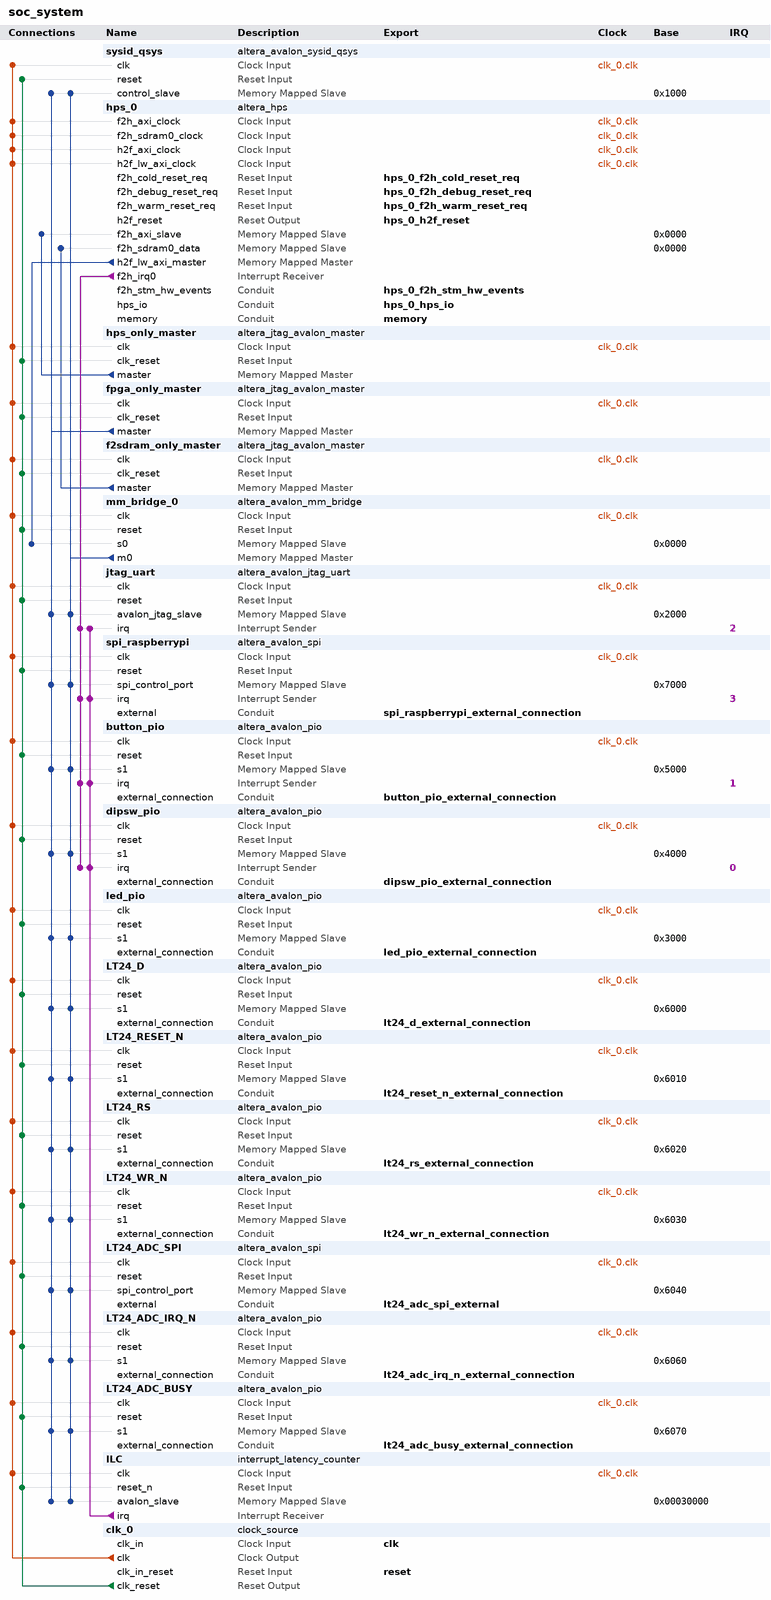
[diagram p0: system contents]
# Platform Designer (Qsys) system soc_system, Cyclone V 5CSEBA6U23I7
# Parameters at their usual value, and those the tool derives, are not listed.
package require -exact qsys 18.0
create_system soc_system
set_project_property DEVICE_FAMILY {Cyclone V}
set_project_property DEVICE 5CSEBA6U23I7

add_instance sysid_qsys altera_avalon_sysid_qsys 18.0
set_instance_parameter_value sysid_qsys id -1395322110

add_instance hps_0 altera_hps 18.0
set_instance_parameter_value hps_0 EMAC1_Mode RGMII
set_instance_parameter_value hps_0 EMAC1_PinMuxing {HPS I/O Set 0}
set_instance_parameter_value hps_0 F2SCLK_COLDRST_Enable true
set_instance_parameter_value hps_0 F2SCLK_DBGRST_Enable true
set_instance_parameter_value hps_0 F2SCLK_WARMRST_Enable true
set_instance_parameter_value hps_0 F2SDRAM_Type {Avalon-MM Bidirectional}
set_instance_parameter_value hps_0 F2SDRAM_Width 256
set_instance_parameter_value hps_0 F2SINTERRUPT_Enable true
set_instance_parameter_value hps_0 F2S_Width 2
set_instance_parameter_value hps_0 FPGA_PERIPHERAL_OUTPUT_CLOCK_FREQ_EMAC0_GTX_CLK 100
set_instance_parameter_value hps_0 FPGA_PERIPHERAL_OUTPUT_CLOCK_FREQ_EMAC0_MD_CLK 100.0
set_instance_parameter_value hps_0 FPGA_PERIPHERAL_OUTPUT_CLOCK_FREQ_EMAC1_GTX_CLK 100
set_instance_parameter_value hps_0 FPGA_PERIPHERAL_OUTPUT_CLOCK_FREQ_EMAC1_MD_CLK 100.0
set_instance_parameter_value hps_0 HPS_PROTOCOL DDR3
set_instance_parameter_value hps_0 I2C0_Mode I2C
set_instance_parameter_value hps_0 I2C0_PinMuxing {HPS I/O Set 0}
set_instance_parameter_value hps_0 I2C1_Mode I2C
set_instance_parameter_value hps_0 I2C1_PinMuxing {HPS I/O Set 0}
set_instance_parameter_value hps_0 LWH2F_Enable true
set_instance_parameter_value hps_0 MEM_BANKADDR_WIDTH 3
set_instance_parameter_value hps_0 MEM_CLK_FREQ 400.0
set_instance_parameter_value hps_0 MEM_COL_ADDR_WIDTH 10
set_instance_parameter_value hps_0 MEM_DQ_WIDTH 32
set_instance_parameter_value hps_0 MEM_DRV_STR RZQ/6
set_instance_parameter_value hps_0 MEM_ROW_ADDR_WIDTH 15
set_instance_parameter_value hps_0 MEM_RTT_NOM RZQ/6
set_instance_parameter_value hps_0 MEM_RTT_WR {Dynamic ODT off}
set_instance_parameter_value hps_0 MEM_TCL 7
set_instance_parameter_value hps_0 MEM_TFAW_NS 37.5
set_instance_parameter_value hps_0 MEM_TRAS_NS 35.0
set_instance_parameter_value hps_0 MEM_TRCD_NS 13.75
set_instance_parameter_value hps_0 MEM_TRFC_NS 300.0
set_instance_parameter_value hps_0 MEM_TRP_NS 13.75
set_instance_parameter_value hps_0 MEM_VENDOR Other
set_instance_parameter_value hps_0 MEM_WTCL 7
set_instance_parameter_value hps_0 QSPI_Mode N/A
set_instance_parameter_value hps_0 QSPI_PinMuxing Unused
set_instance_parameter_value hps_0 REF_CLK_FREQ 25.0
set_instance_parameter_value hps_0 S2FCLK_USER2CLK 4
set_instance_parameter_value hps_0 S2F_Width 2
set_instance_parameter_value hps_0 SDIO_Mode {4-bit Data}
set_instance_parameter_value hps_0 SDIO_PinMuxing {HPS I/O Set 0}
set_instance_parameter_value hps_0 SPIM1_Mode {Single Slave Select}
set_instance_parameter_value hps_0 SPIM1_PinMuxing {HPS I/O Set 0}
set_instance_parameter_value hps_0 STM_Enable true
set_instance_parameter_value hps_0 TIMING_BOARD_AC_SKEW 0.02
set_instance_parameter_value hps_0 TIMING_BOARD_AC_TO_CK_SKEW 0.0
set_instance_parameter_value hps_0 TIMING_BOARD_DQ_TO_DQS_SKEW 0.0
set_instance_parameter_value hps_0 TIMING_BOARD_MAX_CK_DELAY 0.6
set_instance_parameter_value hps_0 TIMING_BOARD_MAX_DQS_DELAY 0.6
set_instance_parameter_value hps_0 TIMING_BOARD_SKEW_BETWEEN_DQS 0.02
set_instance_parameter_value hps_0 TIMING_BOARD_SKEW_CKDQS_DIMM_MAX 0.01
set_instance_parameter_value hps_0 TIMING_BOARD_SKEW_CKDQS_DIMM_MIN -0.01
set_instance_parameter_value hps_0 TIMING_BOARD_SKEW_WITHIN_DQS 0.02
set_instance_parameter_value hps_0 TIMING_TDH 125
set_instance_parameter_value hps_0 TIMING_TDQSCK 400
set_instance_parameter_value hps_0 TIMING_TDQSQ 120
set_instance_parameter_value hps_0 TIMING_TDS 50
set_instance_parameter_value hps_0 TIMING_TIH 250
set_instance_parameter_value hps_0 TIMING_TIS 175
set_instance_parameter_value hps_0 TIMING_TQSH 0.38
set_instance_parameter_value hps_0 UART0_Mode {No Flow Control}
set_instance_parameter_value hps_0 UART0_PinMuxing {HPS I/O Set 0}
set_instance_parameter_value hps_0 USB1_Mode SDR
set_instance_parameter_value hps_0 USB1_PinMuxing {HPS I/O Set 0}
set_instance_parameter_value hps_0 desired_cfg_clk_mhz 100.0
set_instance_parameter_value hps_0 desired_qspi_clk_mhz 370.0

add_instance hps_only_master altera_jtag_avalon_master 18.0

add_instance fpga_only_master altera_jtag_avalon_master 18.0

add_instance f2sdram_only_master altera_jtag_avalon_master 18.0

add_instance mm_bridge_0 altera_avalon_mm_bridge 18.0
set_instance_parameter_value mm_bridge_0 ADDRESS_UNITS SYMBOLS
set_instance_parameter_value mm_bridge_0 ADDRESS_WIDTH 10
set_instance_parameter_value mm_bridge_0 DATA_WIDTH 32
set_instance_parameter_value mm_bridge_0 MAX_PENDING_RESPONSES 4
set_instance_parameter_value mm_bridge_0 USE_AUTO_ADDRESS_WIDTH 1

add_instance jtag_uart altera_avalon_jtag_uart 18.0
set_instance_parameter_value jtag_uart allowMultipleConnections true
set_instance_parameter_value jtag_uart simInteractiveOptions INTERACTIVE_ASCII_OUTPUT

add_instance spi_raspberrypi altera_avalon_spi 18.0
set_instance_parameter_value spi_raspberrypi clockPolarity 0
set_instance_parameter_value spi_raspberrypi dataWidth 32
set_instance_parameter_value spi_raspberrypi insertSync true
set_instance_parameter_value spi_raspberrypi masterSPI false
set_instance_parameter_value spi_raspberrypi numberOfSlaves 1
set_instance_parameter_value spi_raspberrypi targetClockRate 128000

add_instance button_pio altera_avalon_pio 18.0
set_instance_parameter_value button_pio bitClearingEdgeCapReg true
set_instance_parameter_value button_pio captureEdge true
set_instance_parameter_value button_pio direction Input
set_instance_parameter_value button_pio edgeType FALLING
set_instance_parameter_value button_pio generateIRQ true
set_instance_parameter_value button_pio irqType EDGE
set_instance_parameter_value button_pio width 2

add_instance dipsw_pio altera_avalon_pio 18.0
set_instance_parameter_value dipsw_pio bitClearingEdgeCapReg true
set_instance_parameter_value dipsw_pio captureEdge true
set_instance_parameter_value dipsw_pio direction Input
set_instance_parameter_value dipsw_pio edgeType ANY
set_instance_parameter_value dipsw_pio generateIRQ true
set_instance_parameter_value dipsw_pio irqType EDGE
set_instance_parameter_value dipsw_pio width 4

add_instance led_pio altera_avalon_pio 18.0
set_instance_parameter_value led_pio direction Output
set_instance_parameter_value led_pio resetValue 127
set_instance_parameter_value led_pio width 7

add_instance LT24_D altera_avalon_pio 18.0
set_instance_parameter_value LT24_D direction Output
set_instance_parameter_value LT24_D width 16

add_instance LT24_RESET_N altera_avalon_pio 18.0
set_instance_parameter_value LT24_RESET_N direction Output
set_instance_parameter_value LT24_RESET_N width 1

add_instance LT24_RS altera_avalon_pio 18.0
set_instance_parameter_value LT24_RS direction Output
set_instance_parameter_value LT24_RS width 1

add_instance LT24_WR_N altera_avalon_pio 18.0
set_instance_parameter_value LT24_WR_N direction Output
set_instance_parameter_value LT24_WR_N width 1

add_instance LT24_ADC_SPI altera_avalon_spi 18.0
set_instance_parameter_value LT24_ADC_SPI clockPolarity 0
set_instance_parameter_value LT24_ADC_SPI dataWidth 8
set_instance_parameter_value LT24_ADC_SPI masterSPI true
set_instance_parameter_value LT24_ADC_SPI numberOfSlaves 1
set_instance_parameter_value LT24_ADC_SPI targetClockRate 32000

add_instance LT24_ADC_IRQ_N altera_avalon_pio 18.0
set_instance_parameter_value LT24_ADC_IRQ_N direction Input
set_instance_parameter_value LT24_ADC_IRQ_N width 1

add_instance LT24_ADC_BUSY altera_avalon_pio 18.0
set_instance_parameter_value LT24_ADC_BUSY direction Input
set_instance_parameter_value LT24_ADC_BUSY width 1

add_instance ILC interrupt_latency_counter 18.0
set_instance_parameter_value ILC IRQ_PORT_CNT 4

add_instance clk_0 clock_source 18.0
set_instance_parameter_value clk_0 clockFrequency 50000000

# connections
add_connection clk_0.clk button_pio.clk clock
add_connection clk_0.clk dipsw_pio.clk clock
add_connection clk_0.clk f2sdram_only_master.clk clock
add_connection clk_0.clk fpga_only_master.clk clock
add_connection clk_0.clk hps_0.f2h_axi_clock clock
add_connection clk_0.clk hps_0.f2h_sdram0_clock clock
add_connection clk_0.clk hps_0.h2f_axi_clock clock
add_connection clk_0.clk hps_0.h2f_lw_axi_clock clock
add_connection clk_0.clk hps_only_master.clk clock
add_connection clk_0.clk ILC.clk clock
add_connection clk_0.clk jtag_uart.clk clock
add_connection clk_0.clk led_pio.clk clock
add_connection clk_0.clk LT24_ADC_BUSY.clk clock
add_connection clk_0.clk LT24_ADC_IRQ_N.clk clock
add_connection clk_0.clk LT24_ADC_SPI.clk clock
add_connection clk_0.clk LT24_D.clk clock
add_connection clk_0.clk LT24_RESET_N.clk clock
add_connection clk_0.clk LT24_RS.clk clock
add_connection clk_0.clk LT24_WR_N.clk clock
add_connection clk_0.clk mm_bridge_0.clk clock
add_connection clk_0.clk spi_raspberrypi.clk clock
add_connection clk_0.clk sysid_qsys.clk clock
add_connection clk_0.clk_reset button_pio.reset reset
add_connection clk_0.clk_reset dipsw_pio.reset reset
add_connection clk_0.clk_reset f2sdram_only_master.clk_reset reset
add_connection clk_0.clk_reset fpga_only_master.clk_reset reset
add_connection clk_0.clk_reset hps_only_master.clk_reset reset
add_connection clk_0.clk_reset ILC.reset_n reset
add_connection clk_0.clk_reset jtag_uart.reset reset
add_connection clk_0.clk_reset led_pio.reset reset
add_connection clk_0.clk_reset LT24_ADC_BUSY.reset reset
add_connection clk_0.clk_reset LT24_ADC_IRQ_N.reset reset
add_connection clk_0.clk_reset LT24_ADC_SPI.reset reset
add_connection clk_0.clk_reset LT24_D.reset reset
add_connection clk_0.clk_reset LT24_RESET_N.reset reset
add_connection clk_0.clk_reset LT24_RS.reset reset
add_connection clk_0.clk_reset LT24_WR_N.reset reset
add_connection clk_0.clk_reset mm_bridge_0.reset reset
add_connection clk_0.clk_reset spi_raspberrypi.reset reset
add_connection clk_0.clk_reset sysid_qsys.reset reset
add_connection f2sdram_only_master.master hps_0.f2h_sdram0_data avalon
set_connection_parameter_value f2sdram_only_master.master/hps_0.f2h_sdram0_data baseAddress 0x0000
add_connection fpga_only_master.master button_pio.s1 avalon
set_connection_parameter_value fpga_only_master.master/button_pio.s1 baseAddress 0x5000
add_connection fpga_only_master.master dipsw_pio.s1 avalon
set_connection_parameter_value fpga_only_master.master/dipsw_pio.s1 baseAddress 0x4000
add_connection fpga_only_master.master ILC.avalon_slave avalon
set_connection_parameter_value fpga_only_master.master/ILC.avalon_slave baseAddress 0x00030000
add_connection fpga_only_master.master jtag_uart.avalon_jtag_slave avalon
set_connection_parameter_value fpga_only_master.master/jtag_uart.avalon_jtag_slave baseAddress 0x2000
add_connection fpga_only_master.master led_pio.s1 avalon
set_connection_parameter_value fpga_only_master.master/led_pio.s1 baseAddress 0x3000
add_connection fpga_only_master.master LT24_ADC_BUSY.s1 avalon
set_connection_parameter_value fpga_only_master.master/LT24_ADC_BUSY.s1 baseAddress 0x6070
add_connection fpga_only_master.master LT24_ADC_IRQ_N.s1 avalon
set_connection_parameter_value fpga_only_master.master/LT24_ADC_IRQ_N.s1 baseAddress 0x6060
add_connection fpga_only_master.master LT24_ADC_SPI.spi_control_port avalon
set_connection_parameter_value fpga_only_master.master/LT24_ADC_SPI.spi_control_port baseAddress 0x6040
add_connection fpga_only_master.master LT24_D.s1 avalon
set_connection_parameter_value fpga_only_master.master/LT24_D.s1 baseAddress 0x6000
add_connection fpga_only_master.master LT24_RESET_N.s1 avalon
set_connection_parameter_value fpga_only_master.master/LT24_RESET_N.s1 baseAddress 0x6010
add_connection fpga_only_master.master LT24_RS.s1 avalon
set_connection_parameter_value fpga_only_master.master/LT24_RS.s1 baseAddress 0x6020
add_connection fpga_only_master.master LT24_WR_N.s1 avalon
set_connection_parameter_value fpga_only_master.master/LT24_WR_N.s1 baseAddress 0x6030
add_connection fpga_only_master.master spi_raspberrypi.spi_control_port avalon
set_connection_parameter_value fpga_only_master.master/spi_raspberrypi.spi_control_port baseAddress 0x7000
add_connection fpga_only_master.master sysid_qsys.control_slave avalon
set_connection_parameter_value fpga_only_master.master/sysid_qsys.control_slave baseAddress 0x1000
add_connection hps_0.h2f_lw_axi_master mm_bridge_0.s0 avalon
set_connection_parameter_value hps_0.h2f_lw_axi_master/mm_bridge_0.s0 baseAddress 0x0000
add_connection hps_only_master.master hps_0.f2h_axi_slave avalon
set_connection_parameter_value hps_only_master.master/hps_0.f2h_axi_slave baseAddress 0x0000
add_connection mm_bridge_0.m0 button_pio.s1 avalon
set_connection_parameter_value mm_bridge_0.m0/button_pio.s1 baseAddress 0x5000
add_connection mm_bridge_0.m0 dipsw_pio.s1 avalon
set_connection_parameter_value mm_bridge_0.m0/dipsw_pio.s1 baseAddress 0x4000
add_connection mm_bridge_0.m0 ILC.avalon_slave avalon
set_connection_parameter_value mm_bridge_0.m0/ILC.avalon_slave baseAddress 0x00030000
add_connection mm_bridge_0.m0 jtag_uart.avalon_jtag_slave avalon
set_connection_parameter_value mm_bridge_0.m0/jtag_uart.avalon_jtag_slave baseAddress 0x2000
add_connection mm_bridge_0.m0 led_pio.s1 avalon
set_connection_parameter_value mm_bridge_0.m0/led_pio.s1 baseAddress 0x3000
add_connection mm_bridge_0.m0 LT24_ADC_BUSY.s1 avalon
set_connection_parameter_value mm_bridge_0.m0/LT24_ADC_BUSY.s1 baseAddress 0x6070
add_connection mm_bridge_0.m0 LT24_ADC_IRQ_N.s1 avalon
set_connection_parameter_value mm_bridge_0.m0/LT24_ADC_IRQ_N.s1 baseAddress 0x6060
add_connection mm_bridge_0.m0 LT24_ADC_SPI.spi_control_port avalon
set_connection_parameter_value mm_bridge_0.m0/LT24_ADC_SPI.spi_control_port baseAddress 0x6040
add_connection mm_bridge_0.m0 LT24_D.s1 avalon
set_connection_parameter_value mm_bridge_0.m0/LT24_D.s1 baseAddress 0x6000
add_connection mm_bridge_0.m0 LT24_RESET_N.s1 avalon
set_connection_parameter_value mm_bridge_0.m0/LT24_RESET_N.s1 baseAddress 0x6010
add_connection mm_bridge_0.m0 LT24_RS.s1 avalon
set_connection_parameter_value mm_bridge_0.m0/LT24_RS.s1 baseAddress 0x6020
add_connection mm_bridge_0.m0 LT24_WR_N.s1 avalon
set_connection_parameter_value mm_bridge_0.m0/LT24_WR_N.s1 baseAddress 0x6030
add_connection mm_bridge_0.m0 spi_raspberrypi.spi_control_port avalon
set_connection_parameter_value mm_bridge_0.m0/spi_raspberrypi.spi_control_port baseAddress 0x7000
add_connection mm_bridge_0.m0 sysid_qsys.control_slave avalon
set_connection_parameter_value mm_bridge_0.m0/sysid_qsys.control_slave baseAddress 0x1000
add_connection hps_0.f2h_irq0 button_pio.irq interrupt
set_connection_parameter_value hps_0.f2h_irq0/button_pio.irq irqNumber 1
add_connection hps_0.f2h_irq0 dipsw_pio.irq interrupt
set_connection_parameter_value hps_0.f2h_irq0/dipsw_pio.irq irqNumber 0
add_connection hps_0.f2h_irq0 jtag_uart.irq interrupt
set_connection_parameter_value hps_0.f2h_irq0/jtag_uart.irq irqNumber 2
add_connection hps_0.f2h_irq0 spi_raspberrypi.irq interrupt
set_connection_parameter_value hps_0.f2h_irq0/spi_raspberrypi.irq irqNumber 3
add_connection ILC.irq button_pio.irq interrupt
set_connection_parameter_value ILC.irq/button_pio.irq irqNumber 1
add_connection ILC.irq dipsw_pio.irq interrupt
set_connection_parameter_value ILC.irq/dipsw_pio.irq irqNumber 0
add_connection ILC.irq jtag_uart.irq interrupt
set_connection_parameter_value ILC.irq/jtag_uart.irq irqNumber 2
add_connection ILC.irq spi_raspberrypi.irq interrupt
set_connection_parameter_value ILC.irq/spi_raspberrypi.irq irqNumber 3

# exported interfaces
add_interface button_pio_external_connection conduit end
set_interface_property button_pio_external_connection EXPORT_OF button_pio.external_connection
add_interface clk clock sink
set_interface_property clk EXPORT_OF clk_0.clk_in
add_interface dipsw_pio_external_connection conduit end
set_interface_property dipsw_pio_external_connection EXPORT_OF dipsw_pio.external_connection
add_interface hps_0_f2h_cold_reset_req reset sink
set_interface_property hps_0_f2h_cold_reset_req EXPORT_OF hps_0.f2h_cold_reset_req
add_interface hps_0_f2h_debug_reset_req reset sink
set_interface_property hps_0_f2h_debug_reset_req EXPORT_OF hps_0.f2h_debug_reset_req
add_interface hps_0_f2h_stm_hw_events conduit end
set_interface_property hps_0_f2h_stm_hw_events EXPORT_OF hps_0.f2h_stm_hw_events
add_interface hps_0_f2h_warm_reset_req reset sink
set_interface_property hps_0_f2h_warm_reset_req EXPORT_OF hps_0.f2h_warm_reset_req
add_interface hps_0_h2f_reset reset source
set_interface_property hps_0_h2f_reset EXPORT_OF hps_0.h2f_reset
add_interface hps_0_hps_io conduit end
set_interface_property hps_0_hps_io EXPORT_OF hps_0.hps_io
add_interface led_pio_external_connection conduit end
set_interface_property led_pio_external_connection EXPORT_OF led_pio.external_connection
add_interface lt24_adc_busy_external_connection conduit end
set_interface_property lt24_adc_busy_external_connection EXPORT_OF LT24_ADC_BUSY.external_connection
add_interface lt24_adc_irq_n_external_connection conduit end
set_interface_property lt24_adc_irq_n_external_connection EXPORT_OF LT24_ADC_IRQ_N.external_connection
add_interface lt24_adc_spi_external conduit end
set_interface_property lt24_adc_spi_external EXPORT_OF LT24_ADC_SPI.external
add_interface lt24_d_external_connection conduit end
set_interface_property lt24_d_external_connection EXPORT_OF LT24_D.external_connection
add_interface lt24_reset_n_external_connection conduit end
set_interface_property lt24_reset_n_external_connection EXPORT_OF LT24_RESET_N.external_connection
add_interface lt24_rs_external_connection conduit end
set_interface_property lt24_rs_external_connection EXPORT_OF LT24_RS.external_connection
add_interface lt24_wr_n_external_connection conduit end
set_interface_property lt24_wr_n_external_connection EXPORT_OF LT24_WR_N.external_connection
add_interface memory conduit end
set_interface_property memory EXPORT_OF hps_0.memory
add_interface reset reset sink
set_interface_property reset EXPORT_OF clk_0.clk_in_reset
add_interface spi_raspberrypi_external_connection conduit end
set_interface_property spi_raspberrypi_external_connection EXPORT_OF spi_raspberrypi.external

set_interconnect_requirement {$system} qsys_mm.clockCrossingAdapter HANDSHAKE
set_interconnect_requirement {$system} qsys_mm.maxAdditionalLatency 1

save_system soc_system.qsys
